# EAGLE design stepper_driver (EAGLE 6.2)
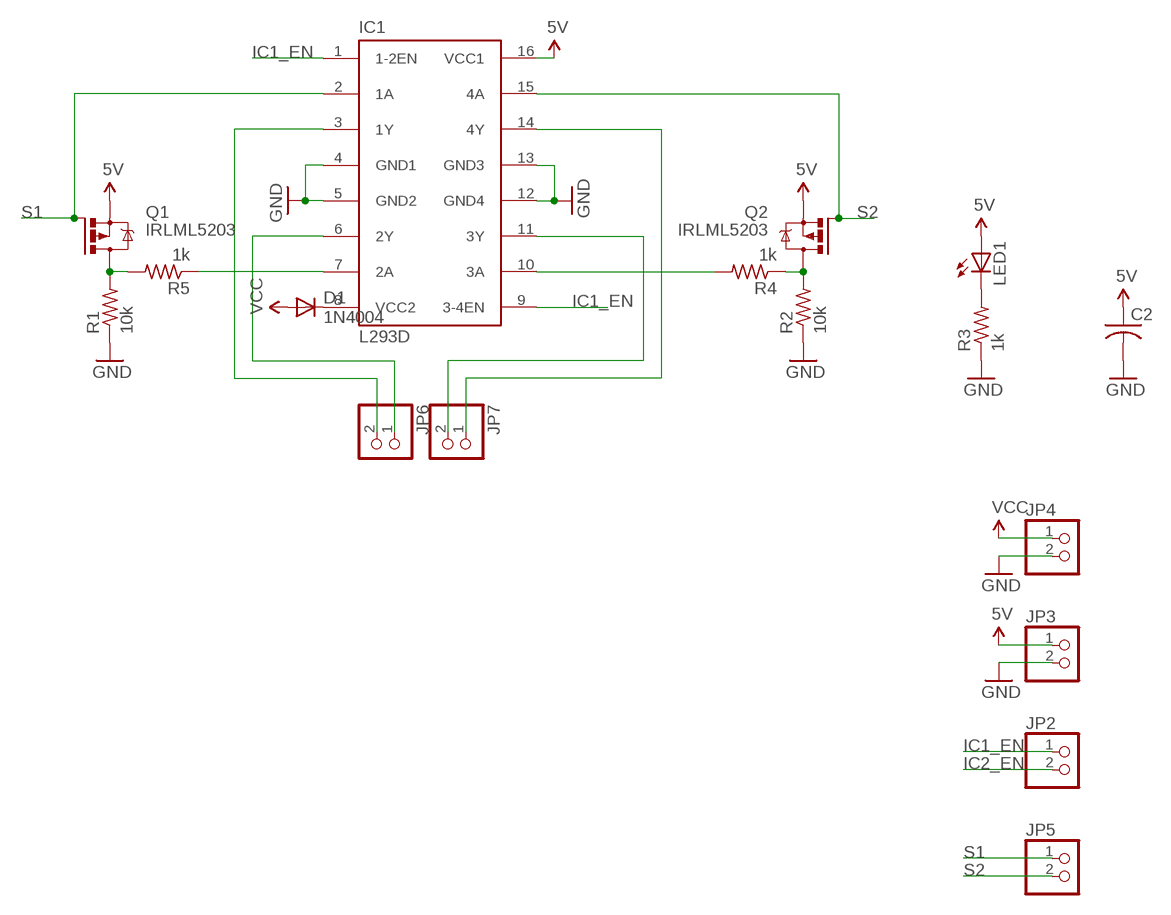
[diagram p0: schematic, sheet 1]

## Parts
C2  C-USC1206  [C1206]
D1  1N4004  [DO41-10]
IC1  L293D  [DIL16]
JP2  PINHD-1X2  [1X02]
JP3  PINHD-1X2  [1X02]
JP4  PINHD-1X2  [1X02]
JP5  PINHD-1X2  [1X02]
JP6  PINHD-1X2  [1X02]
JP7  PINHD-1X2  [1X02]
LED1  LED5MM  [LED5MM]
Q1  IRLML5203  [MICRO3]
Q2  IRLML5203  [MICRO3]
R1  10k  R-US_0207/10  [0207/10]
R2  10k  R-US_0207/10  [0207/10]
R3  1k  R-US_0207/10  [0207/10]
R4  1k  R-US_0207/10  [0207/10]
R5  1k  R-US_0207/10  [0207/10]

## Nets
5V: C2.1 IC1.16(VCC1) JP3.1 LED1.A Q1.2(S) Q2.2(S)
GND: C2.2 IC1.4(GND1) IC1.5(GND2) IC1.12(GND4) IC1.13(GND3) JP3.2 JP4.2 R1.1 R2.1 R3.1
IC1_EN: IC1.1(1-2EN) IC1.9(3-4EN) JP2.1
IC2_EN: JP2.2
N$1: IC1.3(1Y) JP6.2
N$2: IC1.6(2Y) JP6.1
N$3: IC1.11(3Y) JP7.2
N$4: IC1.14(4Y) JP7.1
N$5: IC1.7(2A) R5.1
N$6: D1.C IC1.8(VCC2)
N$7: IC1.10(3A) R4.2
N$10: LED1.K(C) R3.2
N$12: Q1.3(D) R1.2 R5.2
N$13: Q2.3(D) R2.2 R4.1
S1: IC1.2(1A) JP5.1 Q1.1(G)
S2: IC1.15(4A) JP5.2 Q2.1(G)
VCC: D1.A JP4.1

## Library data of the parts
C2 = rcl:C-US: CAPACITOR, American symbol
D1 = diode:1N4004: DIODE general purpose rectifier, 1 A
IC1 = st-microelectronics:L293D: PUSH-PULL 4 CHANNEL DRIVER; MPN: L293D; OC_FARNELL: 9589619; OC_NEWARK: 56P8249
JP2-JP7 = pinhead:PINHD-1X2: PIN HEADER
LED1 = led:LED: LED OSRAM: - CHIPLED LG R971, LG N971, LY N971, LG Q971, LY Q971, LO R971, LY R971 LH N974, LH R974 LS Q976, LO Q976, LY Q976 LO Q996 - Hyper CHIPLED LW Q18S LB Q993, LB Q99A, LB R99A - SideLED LS A670, LO A670, LY A670, LG A670, LP A670 LB A673, LV A673, LT A673, LW A673 LH A674 LY A675 LS A676, LA A676, LO A676, LY A676, LW A676 LS A679, LY A679, LG A679 - Hyper Micro SIDELED® LS Y876, LA Y876, LO Y876, LY Y876 LT Y87S - SmartLED LW L88C, LW L88S LB L89C, LB L89S, LG L890 LS L89K, LO L89K, LY L89K LS L896, LA L896, LO L896, LY L896 - TOPLED LS T670, LO T670, LY T670, LG T670, LP T670 LSG T670, LSP T670, LSY T670, LOP T670, LYG T670 LG T671, LOG T671, LSG T671 LB T673, LV T673, LT T673, LW T673 LH T674 LS T676, LA T676, LO T676, LY T676, LB T676, LH T676, LSB T676, LW T676 LB T67C, LV T67C, LT T67C, LS T67K, LO T67K, LY T67K, LW E67C LS E67B, LA E67B, LO E67B, LY E67B, LB E67C, LV E67C, LT E67C LW T67C LS T679, LY T679, LG T679 LS T770, LO T770, LY T770, LG T770, LP T770 LB T773, LV T773, LT T773, LW T773 LH T774 LS E675, LA E675, LY E675, LS T675 LS T776, LA T776, LO T776, LY T776, LB T776 LHGB T686 LT T68C, LB T68C - Hyper Mini TOPLED® LB M676 - Mini TOPLED Santana® LG M470 LS M47K, LO M47K, LY M47K Source: http://www.osram.convergy.de LUXEON: - LUMILED® LXK2-PW12-R00, LXK2-PW12-S00, LXK2-PW14-U00, LXK2-PW14-V00 LXK2-PM12-R00, LXK2-PM12-S00, LXK2-PM14-U00 LXK2-PE12-Q00, LXK2-PE12-R00, LXK2-PE12-S00, LXK2-PE14-T00, LXK2-PE14-U00 LXK2-PB12-K00, LXK2-PB12-L00, LXK2-PB12-M00, LXK2-PB14-N00, LXK2-PB14-P00, LXK2-PB14-Q00 LXK2-PR12-L00, LXK2-PR12-M00, LXK2-PR14-Q00, LXK2-PR14-R00 LXK2-PD12-Q00, LXK2-PD12-R00, LXK2-PD12-S00 LXK2-PH12-R00, LXK2-PH12-S00 LXK2-PL12-P00, LXK2-PL12-Q00, LXK2-PL12-R00 Source: www.luxeon.com KINGBRIGHT: KA-3528ASYC Source: www.kingbright.com
Q1 Q2 = transistor-power:IRLML5203: HEXFET P-Channel Power MOSFET
R1-R5 = rcl:R-US_: RESISTOR, American symbol

## Board
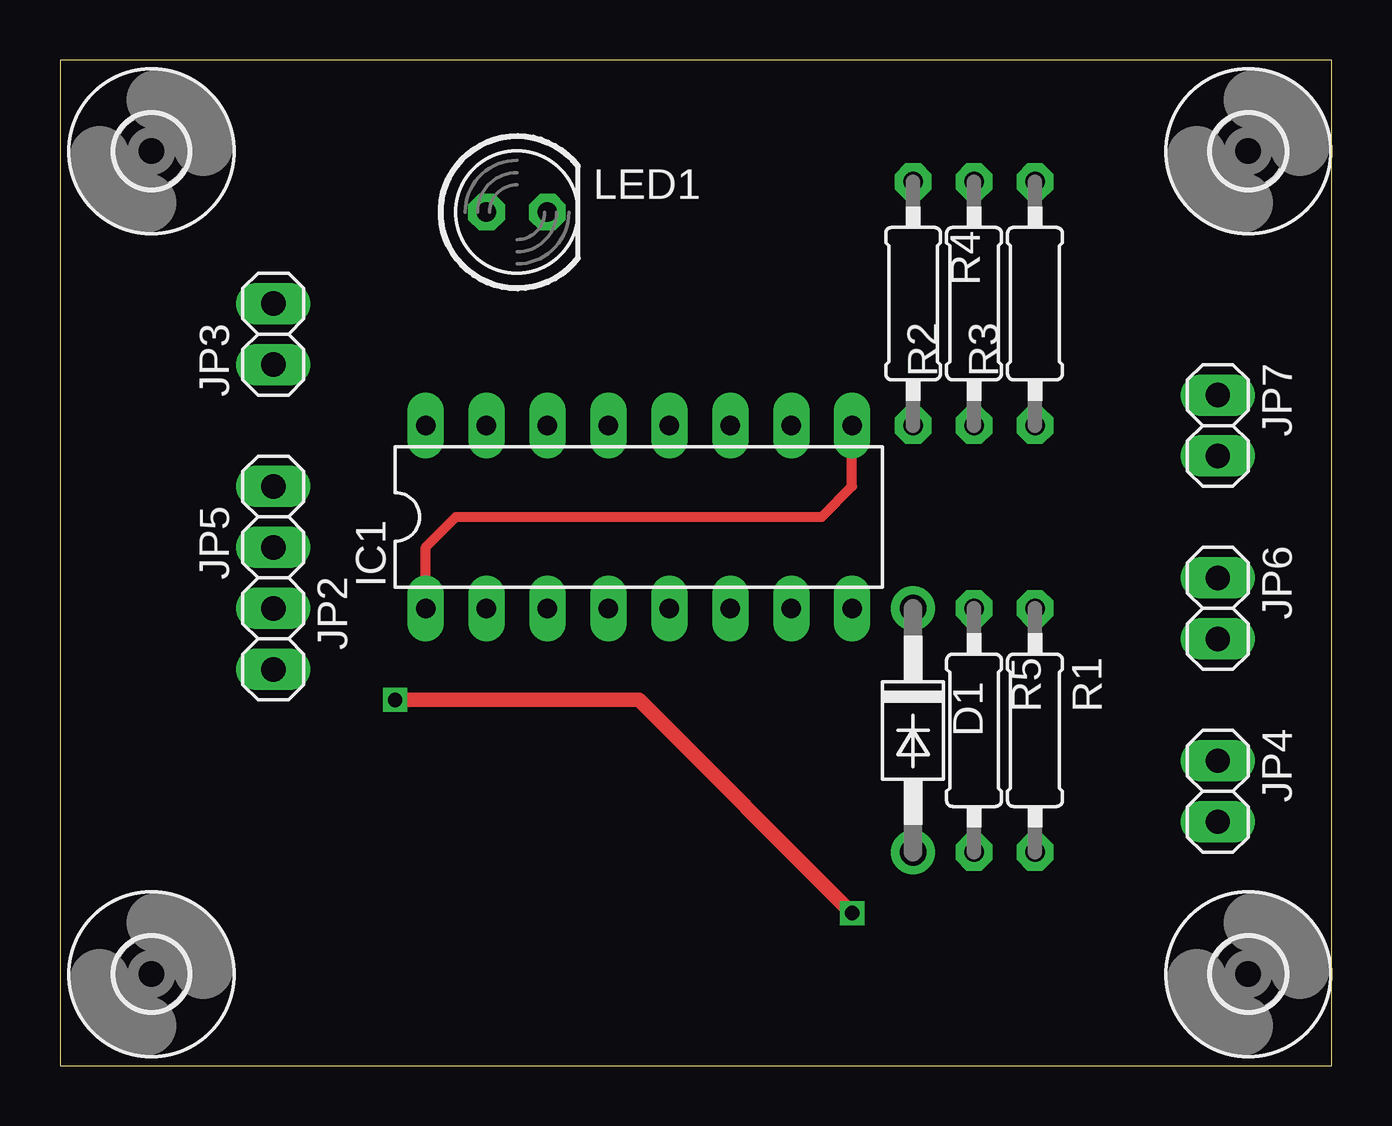
[diagram p1: board, top side]
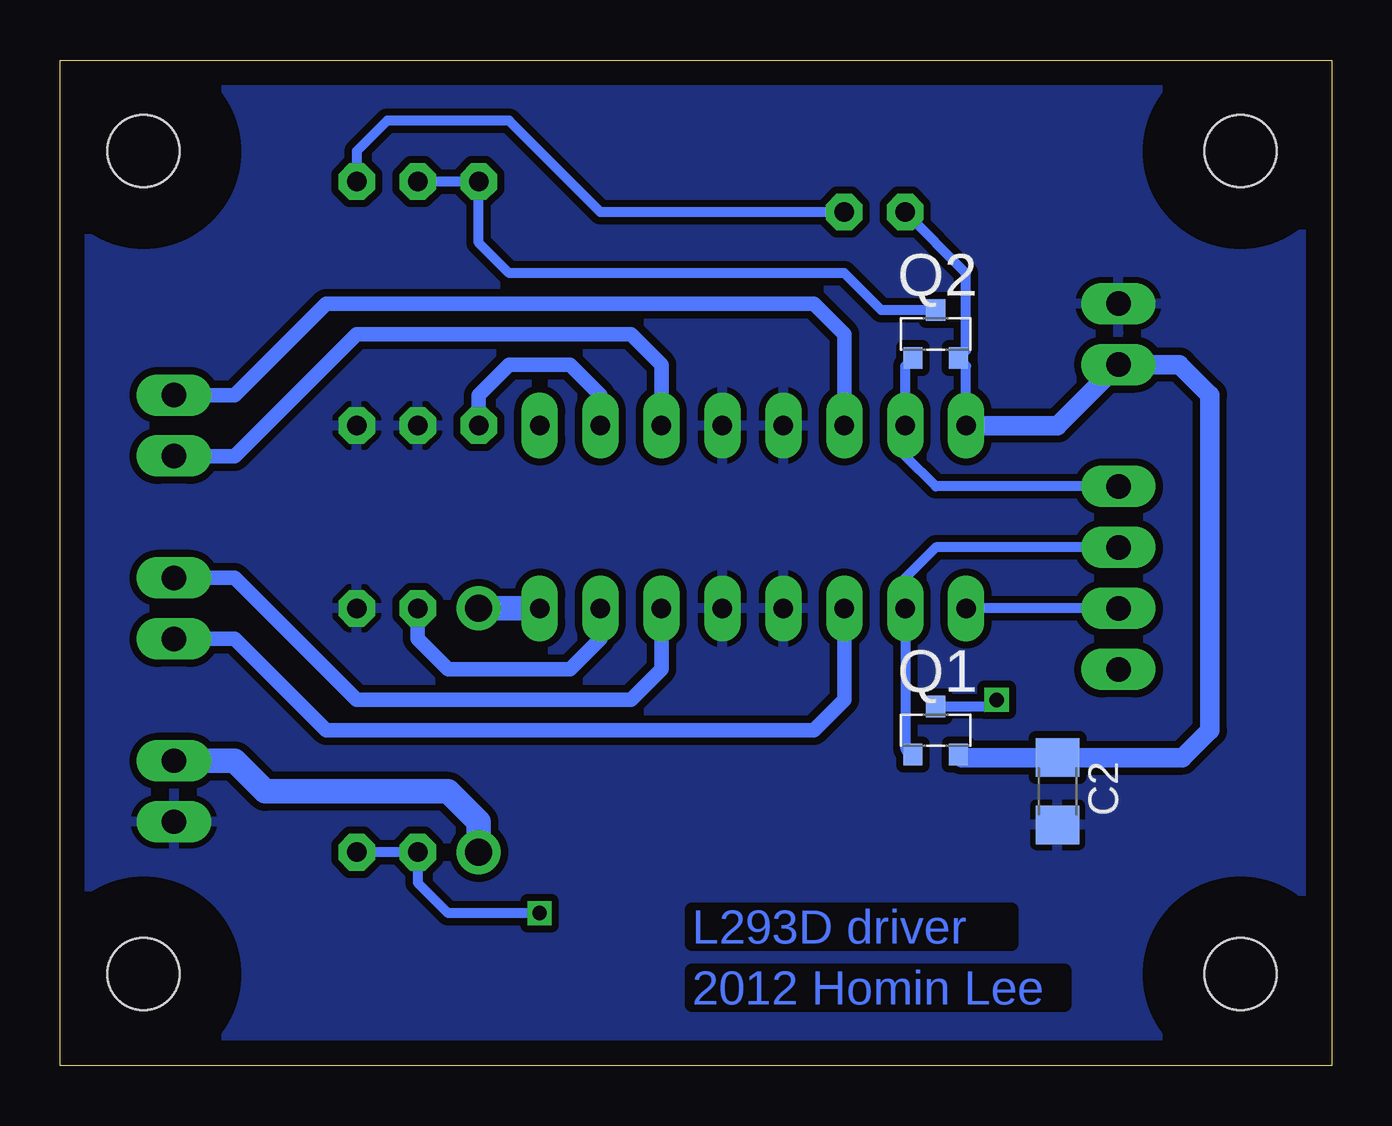
[diagram p2: board, bottom side, seen from below]

Size 53.01 x 41.9 mm. Coordinates in mm from the lower left corner, seen from the top.
Outline: 0,0 53.01,0 53.01,41.9 0,41.9 0,0
Copper layers (1*16): Top 0.035mm / dielectric 1.5mm / Bottom 0.035mm
Design rules: minimum track width 10mil, minimum drill 24mil, track to track 12mil, track to pad 18mil, pad to pad 8mil, via to via 8mil, smd to smd 8mil, copper to edge 40mil, drill to drill 8mil, minimum pad ring 14mil, minimum via ring 8mil, stop-mask expansion 4mil, vias tented up to drill 0mil, thermal gap 10mil

### Footprints (pad centres in the part's own frame; a part is rotated, then mirrored left to right if it is on the bottom)
C1206 = smd 1.6 x 1.8: 1 -1.4,0; 2 1.4,0
DO41-10 = drill 1.118: A 5.08,0; C -5.08,0
DIL16 = drill 0.813 long: 1 -8.89,-3.81; 2 -6.35,-3.81; 3 -3.81,-3.81; 4 -1.27,-3.81; 5 1.27,-3.81; 6 3.81,-3.81; 7 6.35,-3.81; 8 8.89,-3.81; 9 8.89,3.81; 10 6.35,3.81; 11 3.81,3.81; 12 1.27,3.81; 13 -1.27,3.81; 14 -3.81,3.81; 15 -6.35,3.81; 16 -8.89,3.81
1X02 = drill 1.016 long: 1 -1.27,0; 2 1.27,0
LED5MM = drill 0.813 octagon: A -1.27,0; K 1.27,0
MICRO3 = smd 0.8 x 0.9: 1 -0.95,-1; 2 0.95,-1; 3 0,1
0207/10 = drill 0.813 octagon: 1 -5.08,0; 2 5.08,0
3,0 = hole 3: 0,0

### Placement (x,y rotation side)
C2  11.43,11.43 270 bottom
D1  35.56,13.97 270 top
IC1  24.13,22.86 0 top
JP2  8.89,17.78 270 top
JP3  8.89,30.48 90 top
JP4  48.26,11.43 270 top
JP5  8.89,22.86 90 top
JP6  48.26,19.05 270 top
JP7  48.26,26.67 270 top
LED1  19.05,35.56 0 top
Q1  16.51,13.97 0 bottom
Q2  16.51,30.48 0 bottom
R1  40.64,13.97 270 top
R2  38.1,31.75 90 top
R3  40.64,31.75 90 top
R4  35.56,31.75 270 top
R5  38.1,13.97 270 top
U$6  [3,0]  3.81,3.81 0 top
U$7  [3,0]  49.53,38.1 0 top
U$8  [3,0]  3.81,38.1 0 top
U$9  [3,0]  49.53,3.81 0 top

### Tracks (layer width: path | path; a pad name or v marks a point on that pad's centre or on a via)
5V
  Bottom 0.406: IC1.16 15.24,29.16 Q2.2 15.24,29.8 15.24,33.02 LED1.A
  Bottom 0.813: 15.11,26.54 IC1.16 11.43,26.67 JP3.1 6.35,29.21 5.08,27.94 5.08,13.97 6.22,12.83 C2.1 15.42,12.83 Q1.2
GND
  pour Bottom: 1.27,40.64 52.07,40.64 52.07,1.27 1.27,1.27
IC1_EN
  Top 0.406: IC1.1 15.24,21.59 16.51,22.86 31.75,22.86 33.02,24.13 IC1.9
  Bottom 0.406: JP2.1 IC1.1
N$1
  Bottom 0.61: IC1.3 20.32,15.24 21.59,13.97 41.91,13.97 45.72,17.78 JP6.2
N$2
  Bottom 0.61: IC1.6 27.94,16.51 29.21,15.24 40.64,15.24 45.72,20.32 JP6.1
N$3
  Bottom 0.61: IC1.11 27.94,29.21 29.21,30.48 40.64,30.48 45.72,25.4 JP7.2
N$4
  Bottom 0.61: IC1.14 20.32,30.48 21.59,31.75 41.91,31.75 45.72,27.94 JP7.1
N$5
  Bottom 0.61: IC1.7 30.48,17.78 31.75,16.51 36.83,16.51 38.1,17.78 R5.1
N$6
  Bottom 1.016: IC1.8 D1.C
N$7
  Bottom 0.61: IC1.10 30.48,27.94 31.75,29.21 34.29,29.21 35.56,27.94 R4.2
N$10
  Bottom 0.406: LED1.K 30.48,35.56 34.29,39.37 39.37,39.37 40.64,38.1 R3.2
N$12  (via drill 0.6)
  Top 0.61: v13.97,15.24 24.13,15.24 v33.02,6.35
  Bottom 0.406: R1.2 R5.2 38.1,7.62 36.83,6.35 v33.02,6.35 | Q1.3 14.24,14.97 v13.97,15.24
N$13
  Bottom 0.406: Q2.3 18.78,31.48 20.32,33.02 34.29,33.02 35.56,34.29 R4.1 R2.2
S1
  Bottom 0.406: Q1.1 arc90 17.78,13.29 IC1.2 17.78,20.32 16.51,21.59 JP5.1
S2
  Bottom 0.406: Q2.1 17.78,29.16 IC1.15 17.78,25.4 16.51,24.13 JP5.2
VCC
  Bottom 1.016: D1.A 35.56,10.16 36.83,11.43 44.45,11.43 45.72,12.7 JP4.1

### Text on the board
Bottom: L293D driver | 2012 Homin Lee